# Altium project Aixcel_Tiny_STLink_Board.PrjPcb
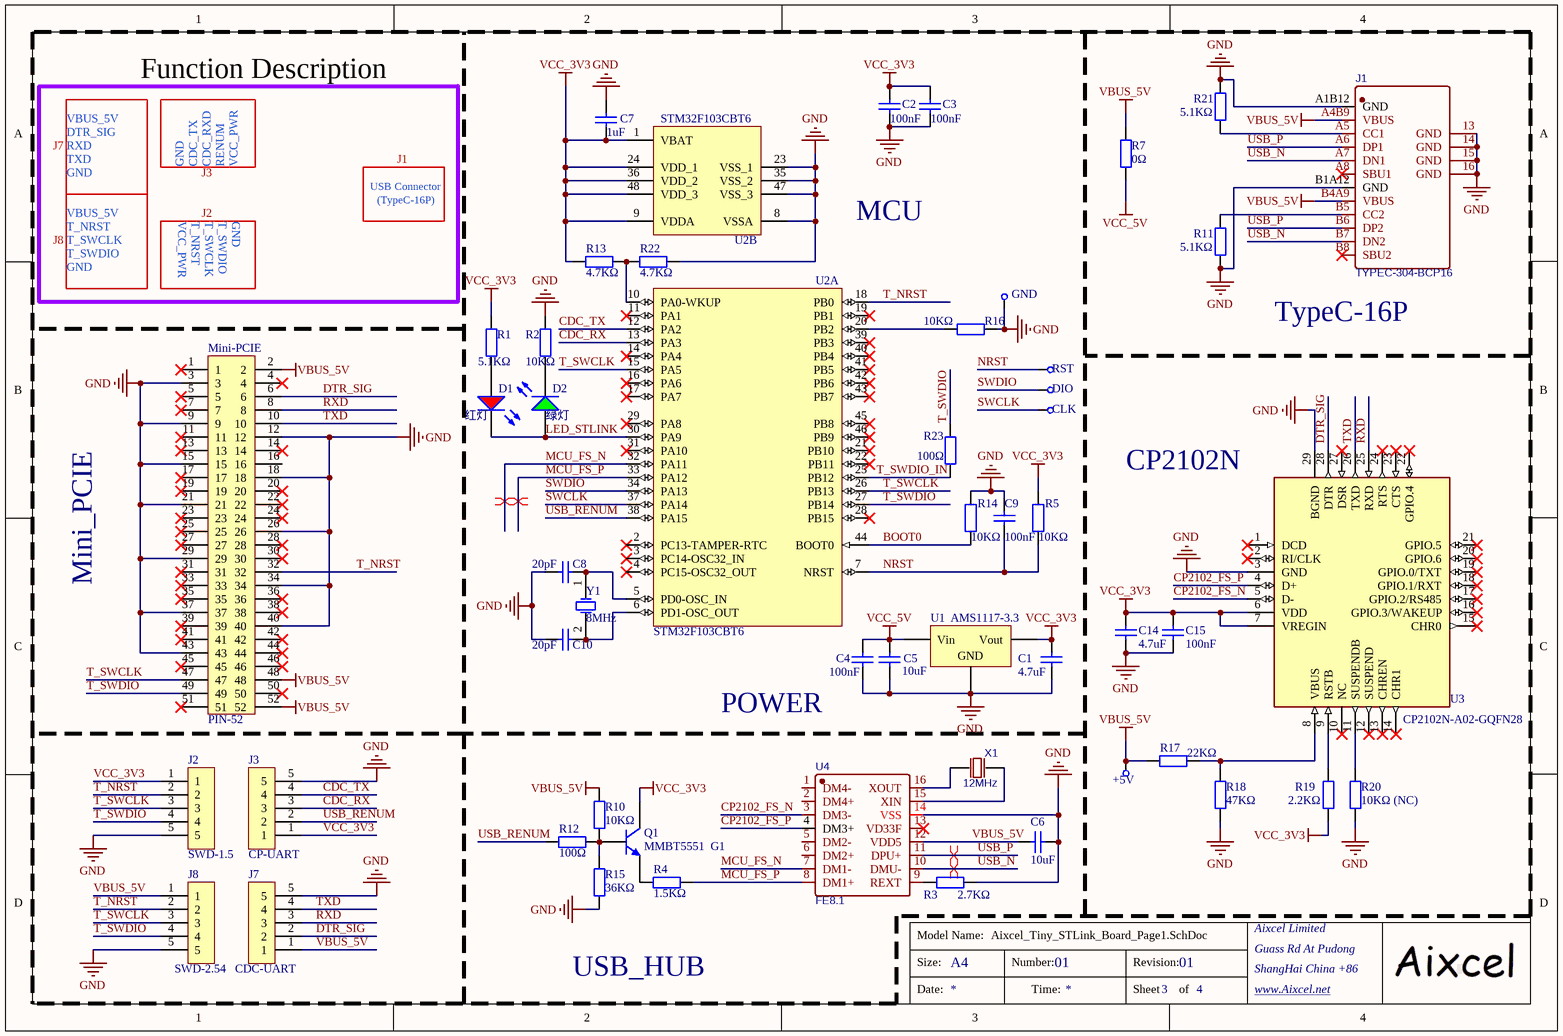
[diagram p0: Aixcel_Tiny_STLink_Board_Page1.SchDoc]
1 sheet, 52 parts. Net scope: global (net labels, ports and power ports of the same name join across sheets).
Board file: Aixcel_Tiny_STLink_Board.PcbDoc

## Sheet Aixcel_Tiny_STLink_Board_Page1.SchDoc
size A4; Organization: Altium Limited; Address1: L3, 12a Rodborough Rd; Address2: Frenchs Forest; Address3: NSW; Address4: Australia 2086; DocumentNumber: 01; Revision: 01; SheetNumber: 3; SheetTotal: 4

### Parts
+5V  CHECK  [CHECK-D]  (value not drawn)
C1  4.7uF  [0603_C]
C2  100nF  [0603_C]
C3  100nF  [0603_C]
C4  100nF  [0603_C]
C5  10uF  [0603_C]
C6  10uF  [0603_C]
C7  1uF  [0603_C]
C8  20pF  [0603_C]
C9  100nF  [0603_C]
C10  20pF  [0603_C]
C14  4.7uF  [0603_C]
C15  100nF  [0603_C]
CLK  CHECK  [CHECK-D]  (value not drawn)
D1  红灯  [0603_LED_S1]
D2  绿灯  [0603_LED_S1]
DIO  CHECK  [CHECK-D]  (value not drawn)
GND  CHECK  [CHECK-D]  (value not drawn)
J1  TYPEC-304-BCP16  [TypeC-16Pin]
J2  SWD-1.5  [ZH1.5-LI-5P]
J3  CP-UART  [ZH1.5-LI-5P]
J7  CDC-UART  [2.54XH接插件5P]
J8  SWD-2.54  [2.54XH接插件5P]
Mini-PCIE  PIN-52  [PCBComponent_1]
Q1  MMBT5551  G1  [SOT-23(SOT-23-3)]
R1  5.1KΩ  [0603_R]
R2  10KΩ  [0603_R]
R3  2.7KΩ  [0603_R]
R4  1.5KΩ  [0603_R]
R5  10KΩ  [0603_R]
R7  0Ω  [0805_R]
R10  10KΩ  [0603_R]
R11  5.1KΩ  [0603_R]
R12  100Ω  [0603_R]
R13  4.7KΩ  [0603_R]
R14  10KΩ  [0603_R]
R15  36KΩ  [0603_R]
R16  10KΩ  [0603_R]
R17  22KΩ  [0603_R]
R18  47KΩ  [0603_R]
R19  2.2KΩ  [0603_R]
R20  10KΩ (NC)  [0603_R]
R21  5.1KΩ  [0603_R]
R22  4.7KΩ  [0603_R]
R23  100Ω  [0603_R]
RST  CHECK  [CHECK-D]  (value not drawn)
U1  AMS1117-3.3  [SOT-223]
U2  STM32F103CBT6  [STM-LQFP48_L]  (parts A,B of 2)
U3  CP2102N-A02-GQFN28  [QFN50P500X500X80-29N-D]
U4  FE8.1  [SSOP-16_L4.9-W3.9-P0.64-LS6.0-BL]
X1  12MHz  [12MHz]
Y1  8MHz  [SMD-5032_2P]

### Nets
GND: C1.1 C2.2 C3.2 C4.1 C5.1 C6.1 C7.2 C8.1 C9.2 C10.1 C14.1 C15.1 GND.1 J1.13(GND) J1.14(GND) J1.15(GND) J1.16(GND) J1.A1B12(GND) J1.B1A12(GND) J2.5 J3.5 J7.5 J8.5 Mini-PCIE.3 Mini-PCIE.9 Mini-PCIE.12 Mini-PCIE.15 Mini-PCIE.18 Mini-PCIE.21 Mini-PCIE.26 Mini-PCIE.29 Mini-PCIE.34 Mini-PCIE.37 Mini-PCIE.40 Mini-PCIE.43 R2.2 R3.2 R11.1 R14.1 R15.1 R16.1 R18.1 R20.2 R21.2 R22.1 U1.1(GND) U2.8(VSSA) U2.23(VSS_1) U2.35(VSS_2) U2.47(VSS_3) U3.3(GND) U3.29(BGND) U4.14(VSS)
VBUS_5V: +5V.1 C6.2 J1.A4B9(VBUS) J1.B4A9(VBUS) J7.1 J8.1 Mini-PCIE.2 Mini-PCIE.48 Mini-PCIE.52 R7.2 R10.2 R17.1 U4.12(VDD5)
VCC_3V3: C1.2 C2.1 C3.1 C7.1 C14.2 C15.2 J2.1 J3.1 Q1.3(C) R1.1 R5.2 R13.2 R19.1 U1.2(Vout) U2.1(VBAT) U2.9(VDDA) U2.24(VDD_1) U2.36(VDD_2) U2.48(VDD_3) U3.6(VDD) U3.7(VREGIN)
VCC_5V: C4.2 C5.2 R7.1 U1.3(Vin)
BOOT0: R14.2 U2.44(BOOT0)
CDC_RX: J3.3 U2.13(PA3)
CDC_TX: J3.4 U2.12(PA2)
CP2102_FS_N: U3.5(D-) U4.3(DM3-)
CP2102_FS_P: U3.4(D+) U4.4(DM3+)
DTR_SIG: J7.2 Mini-PCIE.6 U3.28(DTR)
LED_STLINK: D1.K D2.A U2.30(PA9)
MCU_FS_N: U2.32(PA11) U4.7(DM1-)
MCU_FS_P: R4.1 U2.33(PA12) U4.8(DM1+)
NRST: C9.1 R5.1 RST.1 U2.7(NRST)
RXD: J7.3 Mini-PCIE.8 U3.25(RXD)
SWCLK: CLK.1 U2.37(PA14)
SWDIO: DIO.1 U2.34(PA13)
T_NRST: J2.2 J8.2 Mini-PCIE.32 U2.18(PB0)
T_SWCLK: J2.3 J8.3 Mini-PCIE.47 U2.15(PA5) U2.26(PB13)
T_SWDIO: J2.4 J8.4 Mini-PCIE.49 R23.2 U2.27(PB14)
T_SWDIO_IN: R23.1 U2.25(PB12)
TXD: J7.4 Mini-PCIE.10 U3.26(TXD)
USB_N: J1.A7(DN1) J1.B7(DN2) U4.10(DMU-)
USB_P: J1.A6(DP1) J1.B6(DP2) U4.11(DPU+)
USB_RENUM: J3.2 R12.1 U2.38(PA15)
NetC8_2: C8.2 U2.5(PD0-OSC_IN) Y1.1(OSC1)
NetC10_2: C10.2 U2.6(PD1-OSC_OUT) Y1.2(OSC2)
NetD1_A: D1.A R1.2
NetD2_K: D2.K R2.1
NetJ1_A5: J1.A5(CC1) R21.1
NetJ1_B5: J1.B5(CC2) R11.2
NetQ1_1: Q1.1(B) R10.1 R12.2 R15.2
NetQ1_2: Q1.2(E) R4.2
NetR3_1: R3.1 U4.9(REXT)
NetR13_1: R13.1 R22.2 U2.10(PA0-WKUP)
NetR16_2: R16.2 U2.20(PB2)
NetR17_2: R17.2 R18.2 U3.8(VBUS)
NetR19_2: R19.2 U3.9(RSTB)
NetR20_1: R20.1 U3.11(SUSPENDB)
NetU4_15: U4.15(XIN) X1.2(OSC2)
NetU4_16: U4.16(XOUT) X1.1(OSC1)

Not connected (* = marked no-connect by the designer): J1 A8(SBU1)* B8(SBU2)*; Mini-PCIE 1* 4* 5* 7* 11* 13* 14* 16 17* 19* 20* 22* 23* 24* 25* 27* 28* 30* 31* 33* 35* 36* 38* 39* 41* 42* 44* 45* 46* 50* 51*; U2 2(PC13-TAMPER-RTC)* 3(PC14-OSC32_IN)* 4(PC15-OSC32_OUT)* 11(PA1)* 14(PA4)* 16(PA6)* 17(PA7)* 19(PB1)* 21(PB10)* 22(PB11)* 28(PB15)* 29(PA8)* 31(PA10)* 39(PB3)* 40(PB4)* 41(PB5)* 42(PB6)* 43(PB7)* 45(PB8)* 46(PB9)*; U3 1(DCD)* 2(RI/CLK)* 10(NC)* 12(SUSPEND)* 13(CHREN)* 14(CHR1)* 15(CHR0)* 16(GPIO.3/WAKEUP)* 17(GPIO.2/RS485)* 18(GPIO.1/RXT)* 19(GPIO.0/TXT)* 20(GPIO.6)* 21(GPIO.5)* 22(GPIO.4)* 23(CTS)* 24(RTS)* 27(DSR)*; U4 1(DM4-) 2(DM4+) 5(DM2-) 6(DM2+) 13(VD33F)*

### Layout directives
differential pair: MCU_FS_N, MCU_FS_P, USB_N, USB_P

### Notes on the sheet
- Function Description
- J7
- GND
- TXD
- DTR_SIG
- RXD
- VBUS_5V
- J3
- CDC_TX
- CDC_RXD
- RENUM
- VCC_PWR
- J1
- J8
- T_NRST
- T_SWCLK
- J2
- T_SWDIO
- USB Connector
- (TypeC-16P)
- MCU
- (near J1) TypeC-16P
- (near U3) CP2102N
- Mini_PCIE
- POWER
- USB_HUB
- Size:
- Model Name:
- A4
- Number:
- Revision:
- Aixcel Limited
- Guass Rd At Pudong
- ShangHai China +86
- Date:
- Time:
- Sheet
- of
- www.Aixcel.net <http://www.Aixcel.net>

### Library data of the parts
+5V CLK DIO GND RST = CHECK: 测试点
C1 C14 = 0603 4.7uF (475) 10% 16V: 贴片电容; ComponentLink1Description: 供应商链接; ComponentLink1URL: http://www.szlcsc.com/product/details_20375.html; Package: 0603; Supplier: LC; SuppliersPartNumber: C19666
C2-C4 C9 C15 = 0603 100nF (104) 10% 50V: 贴片电容; ComponentLink1Description: 供应商链接; ComponentLink1URL: http://www.szlcsc.com/product/details_15331.html; Package: 0603; Supplier: LC; SuppliersPartNumber: C14663
C5 C6 = 0603 10uF (106) 10% 10V: 贴片电容; ComponentLink1Description: 供应商链接; ComponentLink1URL: http://www.szlcsc.com/product/details_20411.html; Package: 0603; Supplier: LC; SuppliersPartNumber: C19702
C7 = 0603 1uF (105) 10% 50V: 贴片电容; ComponentLink1Description: 供应商链接; ComponentLink1URL: http://www.szlcsc.com/product/details_16531.html; Package: 0603; Supplier: LC; SuppliersPartNumber: C15849
C8 C10 = 0603 20pF (200) 5% 50V: 贴片电容; ComponentLink1Description: 供应商链接; ComponentLink1URL: http://www.szlcsc.com/product/details_2000.html; Package: 0603; Supplier: LC; SuppliersPartNumber: C1648
D1 = 0603 红灯: 发光二极管; ComponentLink1Description: 供应商链接; ComponentLink1URL: http://www.szlcsc.com/product/details_2659.html; Package: 0603; Supplier: LC; SuppliersPartNumber: C2286
D2 = 0603 绿灯: 发光二极管; ComponentLink1Description: 供应商链接; ComponentLink1URL: http://www.szlcsc.com/product/details_73152.html; Package: 0603; Supplier: LC; SuppliersPartNumber: C72043
J1 = TYPEC-304-BCP16: BOM_Manufacturer: XUNPU; Contributor: LCSC; BOM_Supplier: LCSC; BOM_Supplier Part: C720629; BOM_Manufacturer Part: TYPEC-304-BCP16; BOM_JLCPCB Part Class: Extended Part; spicePre: U; spiceSymbolName: TYPEC-304-BCP16
J2 J3 J7 J8 = SIP-5
Q1 = SOT-23 MMBT5551  G1: 三极管; ComponentLink1Description: 供应商链接; ComponentLink1URL: http://www.szlcsc.com/product/details_2502.html; Package: SOT-23; Supplier: LC; SuppliersPartNumber: C2145
R1 R11 R21 = 0603 5.1KΩ (5101) 1%: 贴片电阻; ComponentLink1Description: 供应商链接; ComponentLink1URL: http://www.szlcsc.com/product/details_23913.html; Package: 0603; Supplier: LC; SuppliersPartNumber: C23186
R2 R5 R10 R14 R16 R20 = 0603 10KΩ (1002) 1%: 贴片电阻; ComponentLink1Description: 供应商链接; ComponentLink1URL: http://www.szlcsc.com/product/details_26547.html; Package: 0603; Supplier: LC; SuppliersPartNumber: C25804
R3 = 0603 2.7KΩ (2701) 1%: 贴片电阻; ComponentLink1Description: 供应商链接; ComponentLink1URL: http://www.szlcsc.com/product/details_13814.html; Package: 0603; Supplier: LC; SuppliersPartNumber: C13167
R4 = 0603 1.5KΩ (1501) 1%: 贴片电阻; ComponentLink1Description: 供应商链接; ComponentLink1URL: http://www.szlcsc.com/product/details_23570.html; Package: 0603; Supplier: LC; SuppliersPartNumber: C22843
R7 = 0805 0Ω (0R0) 1%: 贴片电阻; ComponentLink1Description: 供应商链接; ComponentLink1URL: http://www.szlcsc.com/product/details_18165.html; Package: 0805; Supplier: LC; SuppliersPartNumber: C17477
R12 R23 = 0603 100Ω (1000) 1%: 贴片电阻; ComponentLink1Description: 供应商链接; ComponentLink1URL: http://www.szlcsc.com/product/details_23502.html; Package: 0603; Supplier: LC; SuppliersPartNumber: C22775
R13 R22 = 0603 4.7KΩ (4701) 1%: 贴片电阻; ComponentLink1Description: 供应商链接; ComponentLink1URL: http://www.szlcsc.com/product/details_23889.html; Package: 0603; Supplier: LC; SuppliersPartNumber: C23162
R15 = 0603 36KΩ (3602) 1%: 贴片电阻; ComponentLink1Description: 供应商链接; ComponentLink1URL: http://www.szlcsc.com/product/details_23874.html; Package: 0603; Supplier: LC; SuppliersPartNumber: C23147
R17 = 0603 22KΩ (2202) 1%: 贴片电阻; ComponentLink1Description: 供应商链接; ComponentLink1URL: http://www.szlcsc.com/product/details_32812.html; Package: 0603; Supplier: LC; SuppliersPartNumber: C31850
R18 = 0603 47KΩ (4702) 1%: 贴片电阻; ComponentLink1Description: 供应商链接; ComponentLink1URL: http://www.szlcsc.com/product/details_26562.html; Package: 0603; Supplier: LC; SuppliersPartNumber: C25819
R19 = 0603 2.2KΩ (2201) 1%: 贴片电阻; ComponentLink1Description: 供应商链接; ComponentLink1URL: http://www.szlcsc.com/product/details_4597.html; Package: 0603; Supplier: LC; SuppliersPartNumber: C4190
U1 = SOT-223 AMS1117-3.3: 低压差线性稳压(LDO); ComponentLink1Description: 供应商链接; ComponentLink1URL: http://www.szlcsc.com/product/details_6652.html; Package: SOT-223; Supplier: LC; SuppliersPartNumber: C6186
U2 = STM32F103CBT6: ARM Cortex-M3 32-bit MCU, 128 KB Flash, 20 KB Internal RAM, 37 I/Os, 48-pin LQFP, -40 to 85 degC, Tray; A/D Converter: 2x12-bit (10 Channel); FLASH Size (Prog) (kB): 128; I/Os (High Current): 37; Internal RAM Size (kB): 20; Operating Frequency(F) (Processor speed) (MHz): 72; Supply Voltage(Vcc) min (V): 2; DatasheetVersion: Rev. 16; PackageVersion: Rev. 6, 06/2013; PackageReference: LQFP48; PackageDescription: 48-Pin Low Profile Quad Flat Package, 7 x 7 mm Body, 0.5 mm Pitch; Supplier 1: Digi-Key; Supplier Part Number 1: 497-6288-ND; Supplier 2: Farnell; Supplier Part Number 2: 1606327; Supplier 3: Newark; Supplier Part Number 3: 11N8296; Supplier 4: Newark; Supplier Part Number 4: 57P1214; Supplier 5: Mouser; Supplier Part Number 5: 511-STM32F103CBT6; Core: ARM Cortex-M3; Packing: Tray; Mounting Technology: Surface Mount; PartNumber: STM32F103CBT6; ComponentLink1Description: Manufacturer URL; ComponentLink1URL: http://www.st.com/web/en/home.html; ComponentLink2Description: Datasheet; ComponentLink2URL: http://www.st.com/st-web-ui/static/active/en/resource/technical/document/datasheet/CD00161566.pdf; ComponentLink3Description: Package Specification; ComponentLink3URL: http://www.st.com/st-web-ui/static/active/en/resource/technical/document/datasheet/DM00058181.pdf
U3 = CP2102N-A02-GQFN28: Integrated Circuit; Manufacturer_Name: Silicon Labs; Datasheet Link: https://componentsearchengine.com/Datasheets/1/CP2102N-A02-GQFN28.pdf; Height: 0.8mm; Mouser2 Part Number: 634-CP2102NA02GQFN28; Mouser2 Price/Stock: https://www.mouser.com/Search/Refine.aspx?Keyword=634-CP2102NA02GQFN28; Manufacturer_Part_Number: CP2102N-A02-GQFN28
U4 = FE8.1: Contributor: 私有工程; SMT Type: Extend; BOM_Supplier: zhqsoft; BOM_LCSC Assembly: Yes; spicePre: U; spiceSymbolName: FE8.1
X1 = 12MHz: BOM_Manufacturer: YXC; BOM_Manufacturer Part: X503212MSD2GC; nameAlias: Frequency; BOM_Supplier Part: C33728; BOM_Supplier: LCSC; BOM_JLCPCB Part Class: Extended Part; spicePre: X; spiceSymbolName: X503212MSD2GC
Y1 = SMD-5032_2P 8MHz 20ppm 20pF: 贴片晶振; ComponentLink1Description: 供应商链接; ComponentLink1URL: http://www.szlcsc.com/product/details_117214.html; Package: SMD-5032_2P; Supplier: LC; SuppliersPartNumber: C115962